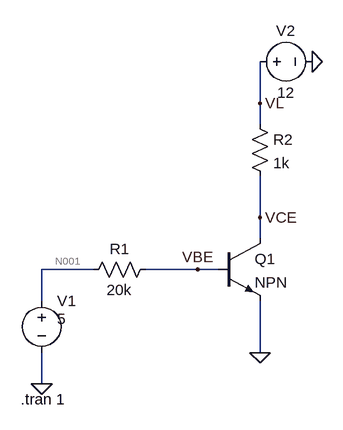
[diagram p0: schematic circuito5.asc]
circuito5.asc, the LTspice schematic file:
Version 4.1
SHEET 1 880 680
WIRE 368 -176 368 -240
WIRE 368 -144 368 -176
WIRE 368 0 368 -64
WIRE 368 32 368 0
WIRE 112 80 32 80
WIRE 272 80 192 80
WIRE 304 80 272 80
WIRE 32 128 32 80
WIRE 368 208 368 128
WIRE 32 256 32 208
FLAG 368 208 0
FLAG 32 256 0
FLAG 448 -240 0
FLAG 272 80 VBE
FLAG 368 0 VCE
FLAG 368 -176 VL
SYMBOL voltage 32 112 R0
WINDOW 3 24 44 Left 2
WINDOW 123 0 0 Left 0
WINDOW 39 0 0 Left 0
SYMATTR Value 5
SYMATTR InstName V1
SYMBOL res 208 64 R90
WINDOW 0 0 56 VBottom 2
WINDOW 3 32 56 VTop 2
SYMATTR InstName R1
SYMATTR Value 20k
SYMBOL npn 304 32 R0
SYMATTR InstName Q1
SYMBOL res 352 -160 R0
SYMATTR InstName R2
SYMATTR Value 1k
SYMBOL voltage 352 -240 R270
WINDOW 0 32 56 VTop 2
WINDOW 3 -32 56 VBottom 2
WINDOW 123 0 0 Left 0
WINDOW 39 0 0 Left 0
SYMATTR InstName V2
SYMATTR Value 12
TEXT 0 280 Left 2 !.tran 1

The netlist it stands for:
* circuito5.asc
V1 N001 0 5
R1 VBE N001 20k
Q1 VCE VBE 0 0 NPN
R2 VL VCE 1k
V2 VL 0 12
.model NPN NPN
.model PNP PNP
.lib standard.bjt
.tran 1
.backanno
.end

* Results of the author's LTspice run, read from the files saved beside the schematic
* Operating Point, zero values left out:
*   V(vbe) = 838.6 mV
*   V(vl) = 12 V
*   V(n001) = 5 V
*   V(vce) = 127.4 mV
*   I(V1) = -208.1 µA
*   Ic(Q1) = 11.87 mA
*   Ib(Q1) = 208.1 µA
*   Ie(Q1) = -12.08 mA
*   I(V2) = -11.87 mA
*   I(R2) = 11.87 mA
*   I(R1) = -208.1 µA
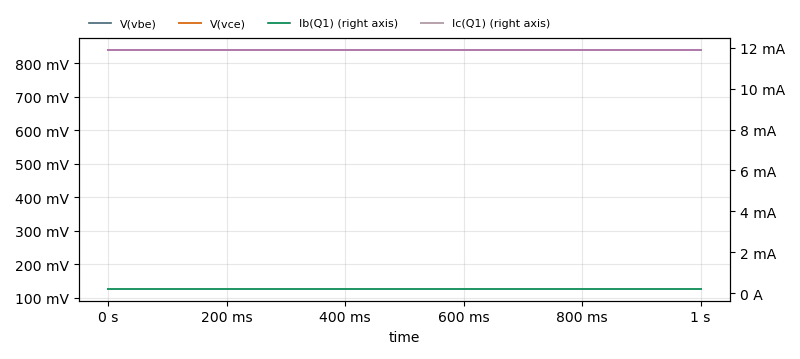
[diagram p1: Transient Analysis of circuito5.asc, plotted from the saved traces]
* Transient Analysis, 1 run:
*   V(vbe): min 838.6 mV, max 838.6 mV, average 838.6 mV, rms 838.6 mV, last 838.6 mV
*   V(vce): min 127.4 mV, max 127.4 mV, average 127.4 mV, rms 127.4 mV, last 127.4 mV
*   Ib(Q1): min 208.1 µA, max 208.1 µA, average 208.1 µA, rms 208.1 µA, last 208.1 µA
*   Ic(Q1): min 11.87 mA, max 11.87 mA, average 11.87 mA, rms 11.87 mA, last 11.87 mA